# EAGLE design bumper (EAGLE 7.6.0)
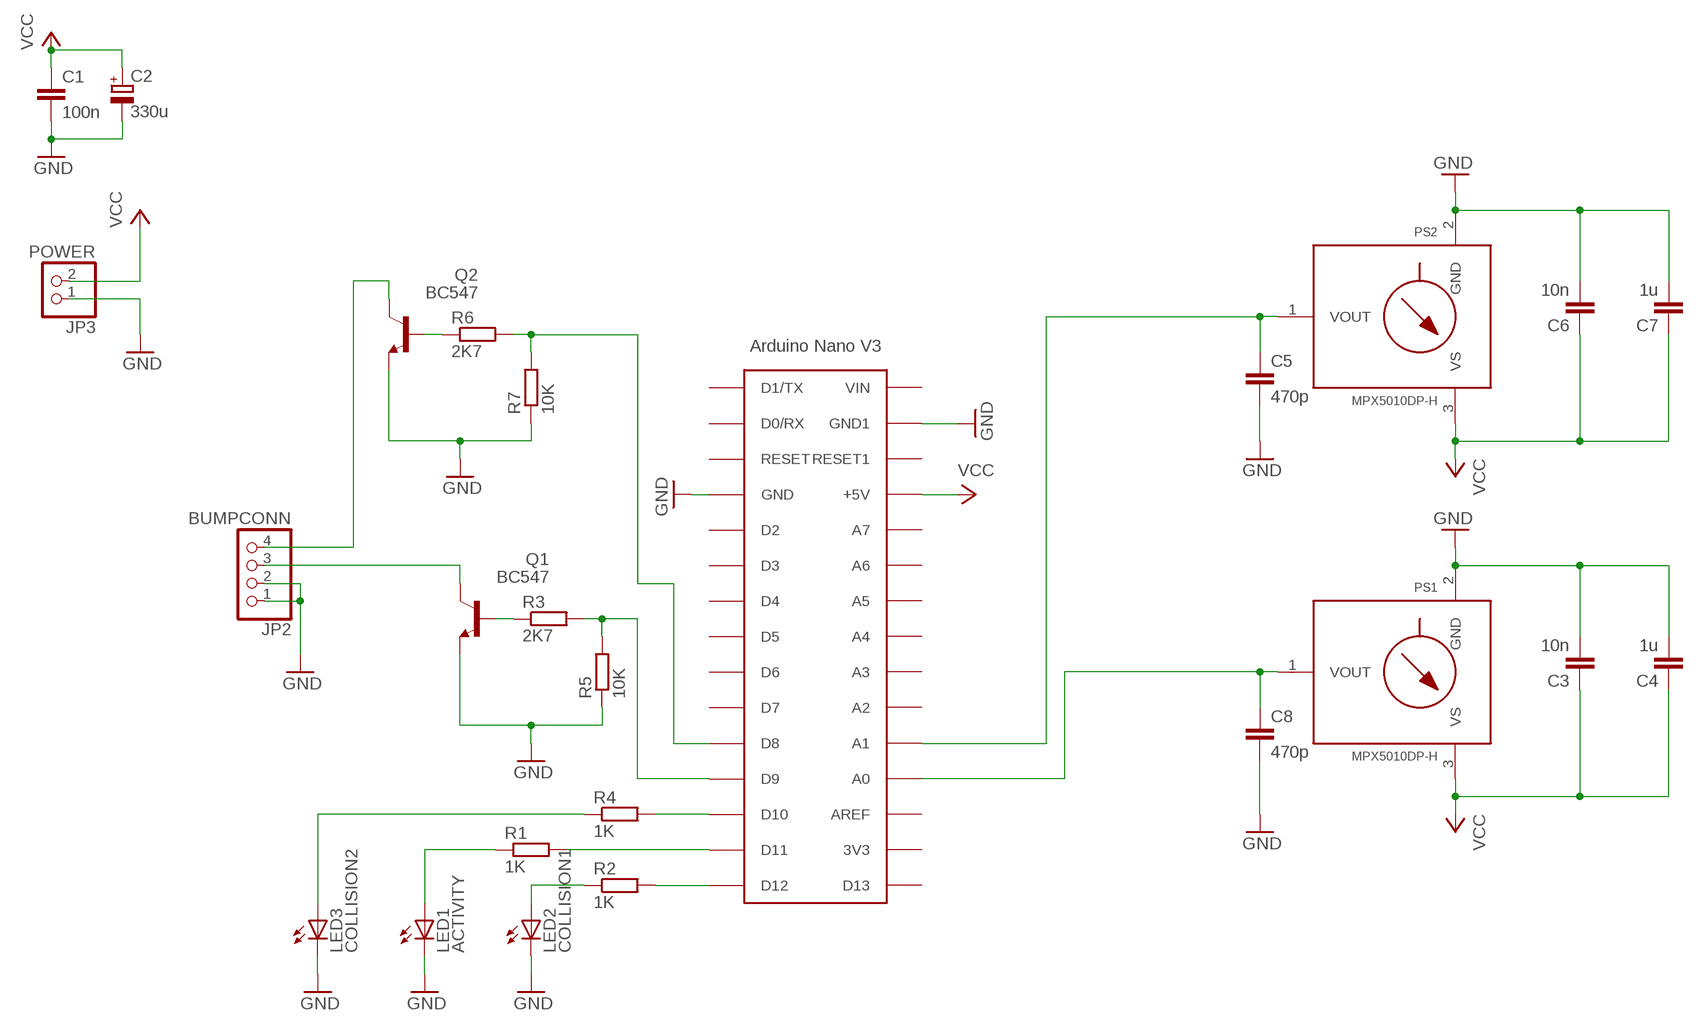
[diagram p0: schematic, sheet 1]

## Parts
C1  100n  C-EU050-024X044  [C050-024X044]
C2  330u  CPOL-EUE2,5-6E  [E2,5-6E]
C3  10n  C-EU050-024X044  [C050-024X044]
C4  1u  C-EU050-035X075  [C050-035X075]
C5  470p  C-EU050-024X044  [C050-024X044]
C6  10n  C-EU050-024X044  [C050-024X044]
C7  1u  C-EU050-035X075  [C050-035X075]
C8  470p  C-EU050-024X044  [C050-024X044]
JP2  BUMPCONN  PINHD-1X4  [1X04]
JP3  POWER  PINHD-1X2  [1X02]
LED1  ACTIVITY  LED5MM  [LED5MM]
LED2  COLLISION1  LED5MM  [LED5MM]
LED3  COLLISION2  LED5MM  [LED5MM]
PS1  MPX5010DP-H  [867C-H]
PS2  MPX5010DP-H  [867C-H]
Q1  BC547  BC548  [TO92-EBC]
Q2  BC547  BC548  [TO92-EBC]
R1  1K  R-EU_0204/7  [0204/7]
R2  1K  R-EU_0204/7  [0204/7]
R3  2K7  R-EU_0204/7  [0204/7]
R4  1K  R-EU_0204/7  [0204/7]
R5  10K  R-EU_0204/7  [0204/7]
R6  2K7  R-EU_0204/7  [0204/7]
R7  10K  R-EU_0204/7  [0204/7]
U$1  ARDUINONANO  [PDIP-32]

## Nets
GND: C1.2 C2.- C3.2 C4.2 C5.2 C6.2 C7.2 C8.2 JP2.1 JP2.2 JP3.1 LED1.K(C) LED2.K(C) LED3.K(C) PS1.2(GND) PS2.2(GND) Q1.E Q2.E R5.1 R7.1 U$1.GND U$1.GND1
N$1: R1.2 U$1.D11
N$2: LED1.A R1.1
N$3: R2.2 U$1.D12
N$4: LED2.A R2.1
N$5: C8.1 PS1.1(VOUT) U$1.A7(A0)
N$6: C5.1 PS2.1(VOUT) U$1.A6(A1)
N$7: R3.2 R5.2 U$1.D9
N$8: Q1.B R3.1
N$9: R6.2 R7.2 U$1.D8
N$10: R4.2 U$1.D10
N$11: JP2.3 Q1.C
N$12: LED3.A R4.1
N$13: Q2.B R6.1
N$14: JP2.4 Q2.C
VCC: C1.1 C2.+ C3.1 C4.1 C6.1 C7.1 JP3.2 PS1.3(VS) PS2.3(VS) U$1.+5V
Unconnected: PS1.4(NC) PS1.5(NC) PS1.6(NC) PS2.4(NC) PS2.5(NC) PS2.6(NC) U$1.3V3 U$1.A0(A7) U$1.A1(A6) U$1.A2(A5) U$1.A3(A4) U$1.A4(A3) U$1.A5(A2) U$1.AREF U$1.D0/RX U$1.D1/TX U$1.D2 U$1.D3 U$1.D4 U$1.D5 U$1.D6 U$1.D7 U$1.D13 U$1.RESET U$1.RESET1 U$1.VIN

## Library data of the parts
C1 C3-C8 = rcl:C-EU: CAPACITOR, European symbol
C2 = rcl:CPOL-EU: POLARIZED CAPACITOR, European symbol
JP2 = pinhead:PINHD-1X4: PIN HEADER
JP3 = pinhead:PINHD-1X2: PIN HEADER
LED1-LED3 = adafruit:LED: LED OSRAM: - CHIPLED LG R971, LG N971, LY N971, LG Q971, LY Q971, LO R971, LY R971 LH N974, LH R974 LS Q976, LO Q976, LY Q976 LO Q996 - Hyper CHIPLED LW Q18S LB Q993, LB Q99A, LB R99A - SideLED LS A670, LO A670, LY A670, LG A670, LP A670 LB A673, LV A673, LT A673, LW A673 LH A674 LY A675 LS A676, LA A676, LO A676, LY A676, LW A676 LS A679, LY A679, LG A679 - Hyper Micro SIDELED® LS Y876, LA Y876, LO Y876, LY Y876 LT Y87S - SmartLED LW L88C, LW L88S LB L89C, LB L89S, LG L890 LS L89K, LO L89K, LY L89K LS L896, LA L896, LO L896, LY L896 - TOPLED LS T670, LO T670, LY T670, LG T670, LP T670 LSG T670, LSP T670, LSY T670, LOP T670, LYG T670 LG T671, LOG T671, LSG T671 LB T673, LV T673, LT T673, LW T673 LH T674 LS T676, LA T676, LO T676, LY T676, LB T676, LH T676, LSB T676, LW T676 LB T67C, LV T67C, LT T67C, LS T67K, LO T67K, LY T67K, LW E67C LS E67B, LA E67B, LO E67B, LY E67B, LB E67C, LV E67C, LT E67C LW T67C LS T679, LY T679, LG T679 LS T770, LO T770, LY T770, LG T770, LP T770 LB T773, LV T773, LT T773, LW T773 LH T774 LS E675, LA E675, LY E675, LS T675 LS T776, LA T776, LO T776, LY T776, LB T776 LHGB T686 LT T68C, LB T68C - Hyper Mini TOPLED® LB M676 - Mini TOPLED Santana® LG M470 LS M47K, LO M47K, LY M47K Source: http://www.osram.convergy.de/
PS1 PS2 = mpx-freescale:MPX5010: Integrated Silicon Pressure Sensor On-Chip Signal Conditioned, Temperature Compensated and Calibrated INTEGRATED PRESSURE SENSOR 0 to 10 kPa (0 to 1.45 psi) 0.2 to 4.7 V OUTPUT
Q1 Q2 = transistor-npn:BC548*: NPN Transistor
R1-R7 = rcl:R-EU_: RESISTOR, European symbol
U$1 = arduinonano:ARDUINONANO: Arduino Nano

## Board
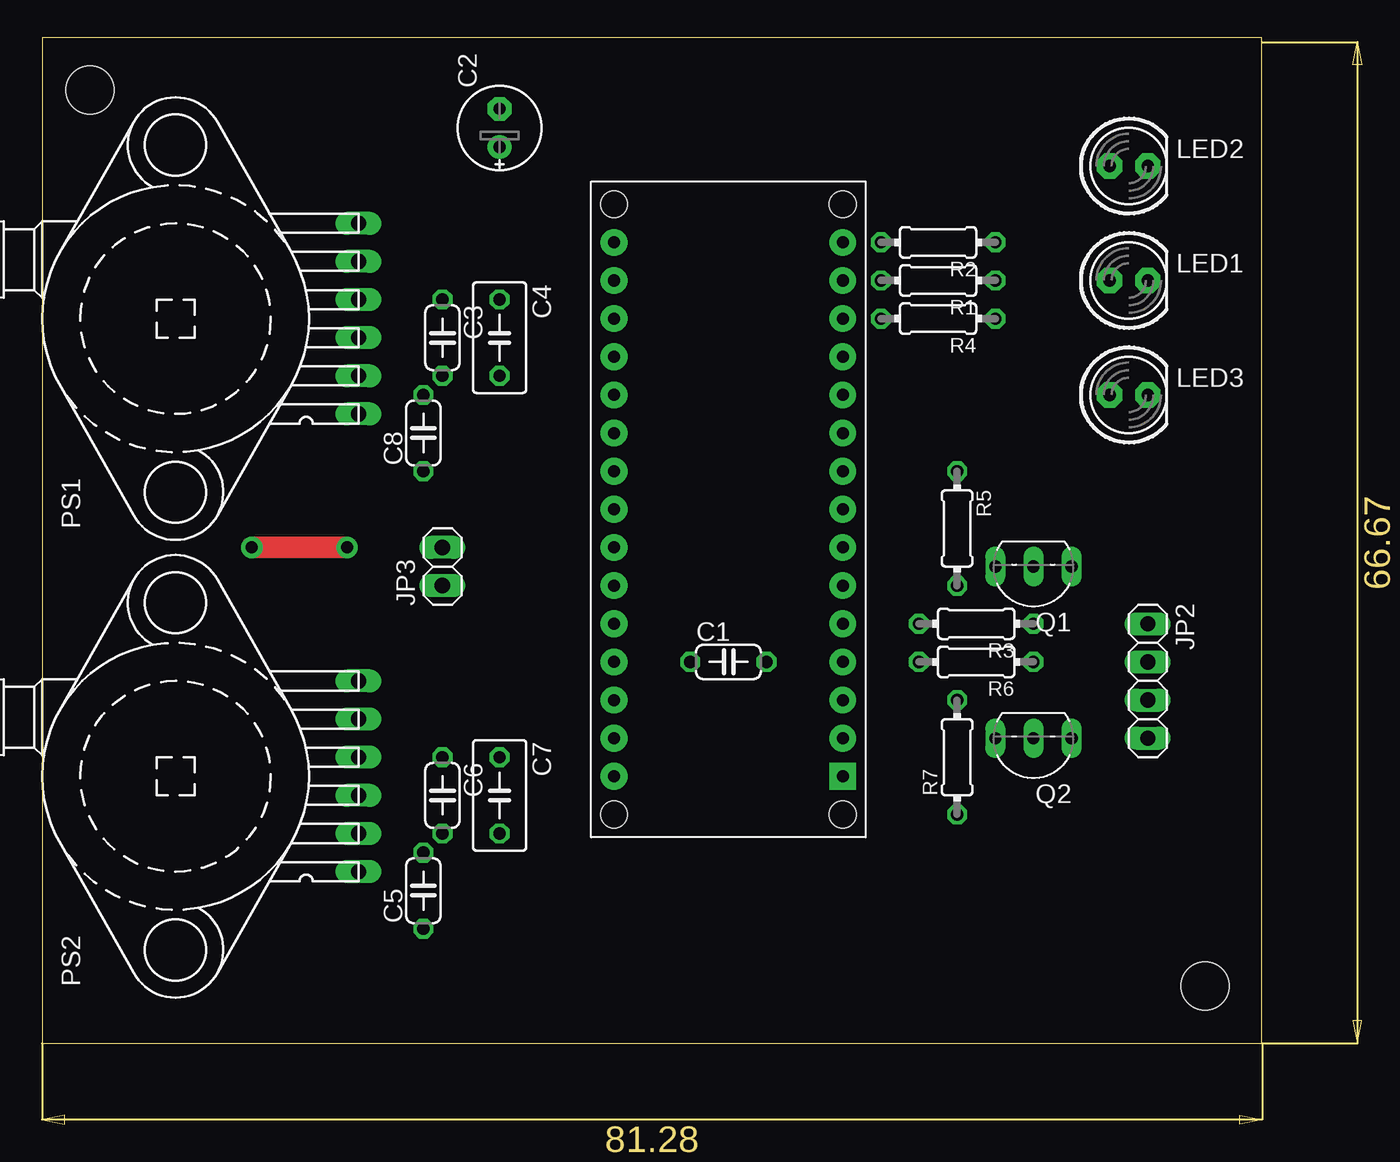
[diagram p1: board, top side]
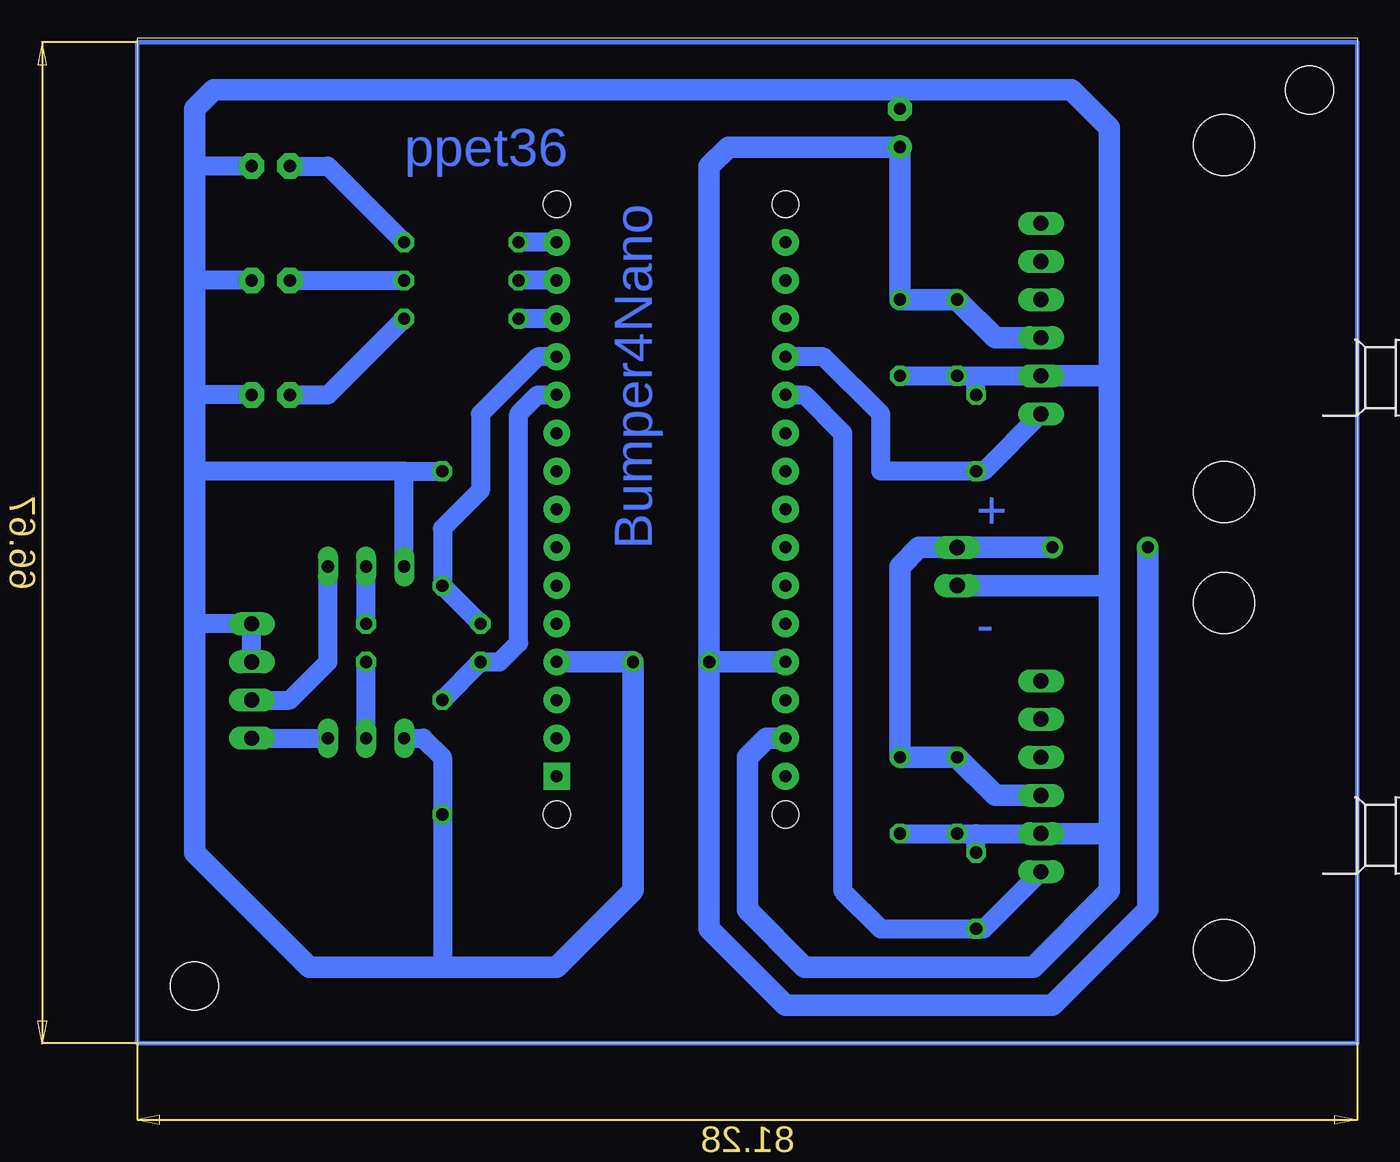
[diagram p2: board, bottom side, seen from below]

Size 81.26 x 66.98 mm. Coordinates in mm from the lower left corner, seen from the top.
Outline: 0,0 81.26,0 81.26,66.98 0,66.98 0,0
Copper layers (1*16): Top 0.035mm / dielectric 1.5mm / Bottom 0.035mm
Design rules "default": minimum track width 10mil, minimum drill 24mil, track to track 8mil, track to pad 8mil, pad to pad 8mil, via to via 8mil, smd to smd 8mil, copper to edge 40mil, drill to drill 8mil, minimum pad ring 10mil, minimum via ring 8mil, stop-mask expansion 4mil, vias tented up to drill 0mil, thermal gap 10mil
Holes 3.2 mm at 77.47,3.81 3.17,63.5

### Footprints (pad centres in the part's own frame; a part is rotated, then mirrored left to right if it is on the bottom)
C050-024X044 = drill 0.813 octagon: 1 -2.54,0; 2 2.54,0
E2,5-6E = drill 0.813 pad 1.575: + -1.27,0 | drill 0.813 pad 1.575 octagon: - 1.27,0
C050-035X075 = drill 0.813 octagon: 1 -2.54,0; 2 2.54,0
1X04 = drill 1.016 long: 1 -3.81,0; 2 -1.27,0; 3 1.27,0; 4 3.81,0
1X02 = drill 1.016 long: 1 -1.27,0; 2 1.27,0
LED5MM = drill 0.813 pad 1.676 octagon: A -1.27,0; K 1.27,0
867C-H = drill 1.016 long: 1 -6.35,-12.192; 2 -3.81,-12.192; 3 -1.27,-12.192; 4 1.27,-12.192; 5 3.81,-12.192; 6 6.35,-12.192 | hole 4.064: -11.557,0; 11.557,0
TO92-EBC = drill 0.813 long: B 0,-1.27; C -2.54,-1.27; E 2.54,-1.27
0204/7 = drill 0.813 octagon: 1 -3.81,0; 2 3.81,0
PDIP-32 = drill 0.8 pad 1.778: 3V3 15.24,-35.56; +5V 15.24,-10.16; A0 15.24,-12.7; A1 15.24,-15.24; A2 15.24,-17.78; A3 15.24,-20.32; A4 15.24,-22.86; A5 15.24,-25.4; A6 15.24,-27.94; A7 15.24,-30.48; AREF 15.24,-33.02; D0/RX 0,-5.08; D2 0,-12.7; D3 0,-15.24; D4 0,-17.78; D5 0,-20.32; D6 0,-22.86; D7 0,-25.4; D8 0,-27.94; D9 0,-30.48; D10 0,-33.02; D11 0,-35.56; D12 0,-38.1; D13 15.24,-38.1; GND 0,-10.16; GND1 15.24,-5.08; RESET 0,-7.62; RESET1 15.24,-7.62; VIN 15.24,-2.54 | drill 0.8 pad 1.778 square: D1/TX 0,-2.54 | hole 1.778: 0,0; 0,-40.64; 15.24,-40.64; 15.24,0

### Placement (x,y rotation side)
C1  45.72,25.4 0 top
C2  30.48,60.96 90 top
C3  26.67,46.99 270 top
C4  30.48,46.99 270 top
C5  25.4,10.16 90 top
C6  26.67,16.51 270 top
C7  30.48,16.51 270 top
C8  25.4,40.64 90 top
JP2  73.66,24.13 270 top
JP3  26.67,31.75 90 top
LED1  72.39,50.8 0 top
LED2  72.39,58.42 0 top
LED3  72.39,43.18 0 top
PS1  8.89,48.26 90 top
PS2  8.89,17.78 90 top
Q1  66.04,30.48 180 top
Q2  66.04,19.05 180 top
R1  59.69,50.8 180 top
R2  59.69,53.34 180 top
R3  62.23,27.94 180 top
R4  59.69,48.26 180 top
R5  60.96,34.29 270 top
R6  62.23,25.4 180 top
R7  60.96,19.05 90 top
U$1  53.34,15.24 180 top

### Tracks (layer width: path | path; a pad name or v marks a point on that pad's centre or on a via)
GND
  Bottom 1.016: C2.- 30.48,63.5
  Bottom 1.27: C7.2 C6.2 25.4,13.97 | 25.4,13.97 PS2.2 | C4.2 C3.2 25.4,44.45 | 25.4,44.45 PS1.2 | 63.5,38.1 R5.1 | Q2.E 62.23,20.32 60.96,19.05 R7.1 60.96,5.08 | JP2.2 JP2.1 77.47,27.94 | Q1.E 63.5,38.1 | 63.5,38.1 77.47,38.1 | LED2.K 77.47,58.42 | LED1.K 77.47,50.8 | LED3.K 77.47,43.18 | C8.2 25.4,44.45 | C5.2 25.4,13.97
  Bottom 1.422: U$1.GND C1.2 48.26,10.16 53.34,5.08 60.96,5.08 69.85,5.08 77.47,12.7 77.47,27.94 77.47,38.1 77.47,43.18 77.47,50.8 77.47,58.42 77.47,62.23 76.2,63.5 30.48,63.5 19.05,63.5 16.51,60.96 16.51,44.45 | 16.51,30.48 16.51,13.97 | 16.51,13.97 16.51,10.16 21.59,5.08 36.83,5.08 40.64,8.89 40.64,19.05 39.37,20.32 U$1.GND1 | 16.51,30.48 16.51,44.45 | PS1.2 16.51,44.45 | JP3.1 16.51,30.48 | PS2.2 16.51,13.97
N$1
  Bottom 1.27: U$1.D11 R1.2
N$2
  Bottom 1.27: LED1.A R1.1
N$3
  Bottom 1.27: U$1.D12 R2.2
N$4
  Bottom 1.27: LED2.A 68.58,58.42 R2.1
N$5
  Bottom 1.27: PS1.1 24.89,38.1 C8.1 31.75,38.1 31.75,41.91 35.56,45.72 U$1.A7
N$6
  Bottom 1.27: PS2.1 24.89,7.62 C5.1 31.75,7.62 34.29,10.16 34.29,40.64 36.83,43.18 U$1.A6
N$7
  Bottom 1.27: U$1.D9 54.61,45.72 58.42,41.91 58.42,36.83 60.96,34.29 R5.2 R3.2
N$8
  Bottom 1.27: R3.1 Q1.B
N$9
  Bottom 1.27: R7.2 R6.2 57.15,25.4 55.88,26.67 55.88,41.91 54.61,43.18 U$1.D8
N$10
  Bottom 1.27: U$1.D10 R4.2
N$11
  Bottom 1.27: JP2.3 71.12,22.86 68.58,25.4 Q1.C
N$12
  Bottom 1.27: LED3.A 68.58,43.18 R4.1
N$13
  Bottom 1.27: Q2.B R6.1
N$14
  Bottom 1.27: JP2.4 Q2.C
N$15
  Bottom 0.305: 0,66.67 81.28,66.67 81.28,0 0,0 0,66.67
VCC  (via drill 0.8 pad 1.42)
  Top 1.422: v13.97,33.02 v20.32,33.02
  Bottom 1.422: PS2.3 24.13,16.51 C6.1 C7.1 30.48,31.75 29.21,33.02 JP3.2 v20.32,33.02 | PS1.3 24.13,46.99 C3.1 C4.1 C2.+ 41.91,59.69 43.18,58.42 C1.1 | U$1.+5V C1.1 | C1.1 43.18,7.62 38.1,2.54 20.32,2.54 13.97,8.89 v13.97,33.02

### Text on the board
Bottom: ppet36 | Bumper4Nano | + | -